# EAGLE design usbtinyisp_th (EAGLE 6.5.0)
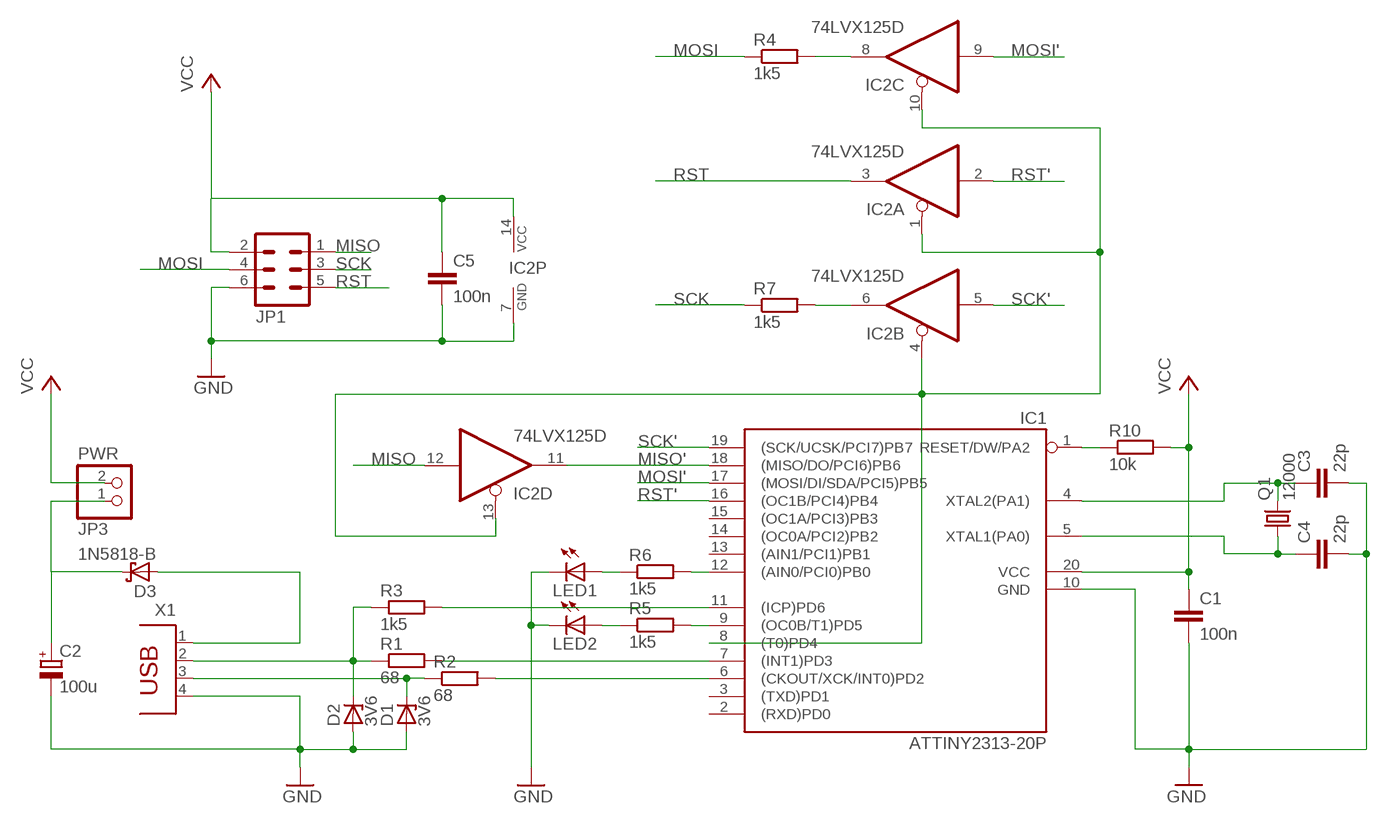
[diagram p0: schematic, sheet 1]

## Parts
C1  100n  C-EU025-025X050  [C025-025X050]
C2  100u  CPOL-EUE2.5-6  [E2,5-6]
C3  22p  C-EU025-025X050  [C025-025X050]
C4  22p  C-EU025-025X050  [C025-025X050]
C5  100n  C-EU025-025X050  [C025-025X050]
D1  3V6  ZENER-DIODEDO35Z10  [DO35Z10]
D2  3V6  ZENER-DIODEDO35Z10  [DO35Z10]
D3  1N5818-B  1N5817-B  [DO41-7.6]
IC1  ATTINY2313-20P  [DIL20]
IC2  74LVX125D  74HC125N  [DIL14]
JP1  MA03-2  [MA03-2]
JP3  PWR  PINHD-1X2  [1X02]
LED1  LED5MM  [LED5MM]
LED2  LED5MM  [LED5MM]
Q1  12000  CRYSTALHC49U-V  [HC49U-V]
R1  68  R-EU_0204/7  [0204/7]
R2  68  R-EU_0204/7  [0204/7]
R3  1k5  R-EU_0204/7  [0204/7]
R4  1k5  R-EU_0204/7  [0204/7]
R5  1k5  R-EU_0204/7  [0204/7]
R6  1k5  R-EU_0204/7  [0204/7]
R7  1k5  R-EU_0204/7  [0204/7]
R10  10k  R-EU_0204/7  [0204/7]
X1  PN61729  [PN61729]

## Nets
GND [supply]: C1.2 C2.- C3.2 C4.2 C5.2 D1.A D2.A IC1.10(GND) IC2.7(P:GND) JP1.6 LED1.K(C) LED2.K(C) X1.4
MISO: IC2.12(D:I) JP1.1
MISO': IC1.18((MISO/DO/PCI6)PB6) IC2.11(D:O)
MOSI: JP1.4 R4.1
MOSI': IC1.17((MOSI/DI/SDA/PCI5)PB5) IC2.9(C:I)
N$1: D2.C R1.1 R3.1 X1.2
N$2: D1.C R2.1 X1.3
N$3: IC1.7((INT1)PD3) R1.2
N$4 [supply]: C2.+ D3.C JP3.1
N$5: LED1.A R6.1
N$6: IC1.6((CKOUT/XCK/INT0)PD2) R2.2
N$7: IC1.12((AIN0/PCI0)PB0) R6.2
N$9: IC1.1(RESET/DW/PA2) R10.1
N$10: IC1.9((OC0B/T1)PD5) R5.2
N$11: LED2.A R5.1
N$12: IC2.6(B:O) R7.2
N$13: IC2.8(C:O) R4.2
N$15: IC1.8((T0)PD4) IC2.1(A:OE) IC2.4(B:OE) IC2.10(C:OE) IC2.13(D:OE)
N$16: IC1.11((ICP)PD6) R3.2
RST: IC2.3(A:O) JP1.5
RST': IC1.16((OC1B/PCI4)PB4) IC2.2(A:I)
SCK: JP1.3 R7.1
SCK': IC1.19((SCK/UCSK/PCI7)PB7) IC2.5(B:I)
VBUS [supply]: D3.A X1.1
VCC [supply]: C1.1 C5.1 IC1.20(VCC) IC2.14(P:VCC) JP1.2 JP3.2 R10.2
XTAL1: C4.1 IC1.5(XTAL1(PA0)) Q1.1
XTAL2: C3.1 IC1.4(XTAL2(PA1)) Q1.2
Unconnected: IC1.2((RXD)PD0) IC1.3((TXD)PD1) IC1.13((AIN1/PCI1)PB1) IC1.14((OC0A/PCI2)PB2) IC1.15((OC1A/PCI3)PB3)

## Library data of the parts
C1 C3-C5 = rcl:C-EU: CAPACITOR, European symbol
C2 = rcl:CPOL-EU: POLARIZED CAPACITOR, European symbol
D1 D2 = diode:ZENER-DIODE: Z-Diode
D3 = diode:1N581*: 1.0A SCHOTTKY BARRIER RECTIFIER Source: http://www.diodes.com/datasheets/ds23001.pdf
IC1 = avr:ATTINY2313: MICROCONTROLLER 2 Kbytes FLASH 128 bytes SRAM 128 bytes EEPROM USART USI
IC2 = 74xx-eu:74*125: Quad bus BUFFER, 3-state
JP1 = con-lstb:MA03-2: PIN HEADER; OC_FARNELL: unknown; OC_NEWARK: unknown
JP3 = pinhead:PINHD-1X2: PIN HEADER
LED1 LED2 = led:LED: LED OSRAM: - CHIPLED LG R971, LG N971, LY N971, LG Q971, LY Q971, LO R971, LY R971 LH N974, LH R974 LS Q976, LO Q976, LY Q976 LO Q996 - Hyper CHIPLED LW Q18S LB Q993, LB Q99A, LB R99A - SideLED LS A670, LO A670, LY A670, LG A670, LP A670 LB A673, LV A673, LT A673, LW A673 LH A674 LY A675 LS A676, LA A676, LO A676, LY A676, LW A676 LS A679, LY A679, LG A679 - Hyper Micro SIDELED® LS Y876, LA Y876, LO Y876, LY Y876 LT Y87S - SmartLED LW L88C, LW L88S LB L89C, LB L89S, LG L890 LS L89K, LO L89K, LY L89K LS L896, LA L896, LO L896, LY L896 - TOPLED LS T670, LO T670, LY T670, LG T670, LP T670 LSG T670, LSP T670, LSY T670, LOP T670, LYG T670 LG T671, LOG T671, LSG T671 LB T673, LV T673, LT T673, LW T673 LH T674 LS T676, LA T676, LO T676, LY T676, LB T676, LH T676, LSB T676, LW T676 LB T67C, LV T67C, LT T67C, LS T67K, LO T67K, LY T67K, LW E67C LS E67B, LA E67B, LO E67B, LY E67B, LB E67C, LV E67C, LT E67C LW T67C LS T679, LY T679, LG T679 LS T770, LO T770, LY T770, LG T770, LP T770 LB T773, LV T773, LT T773, LW T773 LH T774 LS E675, LA E675, LY E675, LS T675 LS T776, LA T776, LO T776, LY T776, LB T776 LHGB T686 LT T68C, LB T68C - Hyper Mini TOPLED® LB M676 - Mini TOPLED Santana® LG M470 LS M47K, LO M47K, LY M47K Source: http://www.osram.convergy.de LUXEON: - LUMILED® LXK2-PW12-R00, LXK2-PW12-S00, LXK2-PW14-U00, LXK2-PW14-V00 LXK2-PM12-R00, LXK2-PM12-S00, LXK2-PM14-U00 LXK2-PE12-Q00, LXK2-PE12-R00, LXK2-PE12-S00, LXK2-PE14-T00, LXK2-PE14-U00 LXK2-PB12-K00, LXK2-PB12-L00, LXK2-PB12-M00, LXK2-PB14-N00, LXK2-PB14-P00, LXK2-PB14-Q00 LXK2-PR12-L00, LXK2-PR12-M00, LXK2-PR14-Q00, LXK2-PR14-R00 LXK2-PD12-Q00, LXK2-PD12-R00, LXK2-PD12-S00 LXK2-PH12-R00, LXK2-PH12-S00 LXK2-PL12-P00, LXK2-PL12-Q00, LXK2-PL12-R00 Source: www.luxeon.com KINGBRIGHT: KA-3528ASYC Source: www.kingbright.com
Q1 = crystal:CRYSTAL: CRYSTAL; OC_FARNELL: 1666969; OC_NEWARK: unknown
R1-R7 R10 = rcl:R-EU_: RESISTOR, European symbol
X1 = con-berg-ez:PN61729: BERG USB connector

## Net classes
0 default: width 0.305 mm
1 supply: width 0.406 mm

## Board
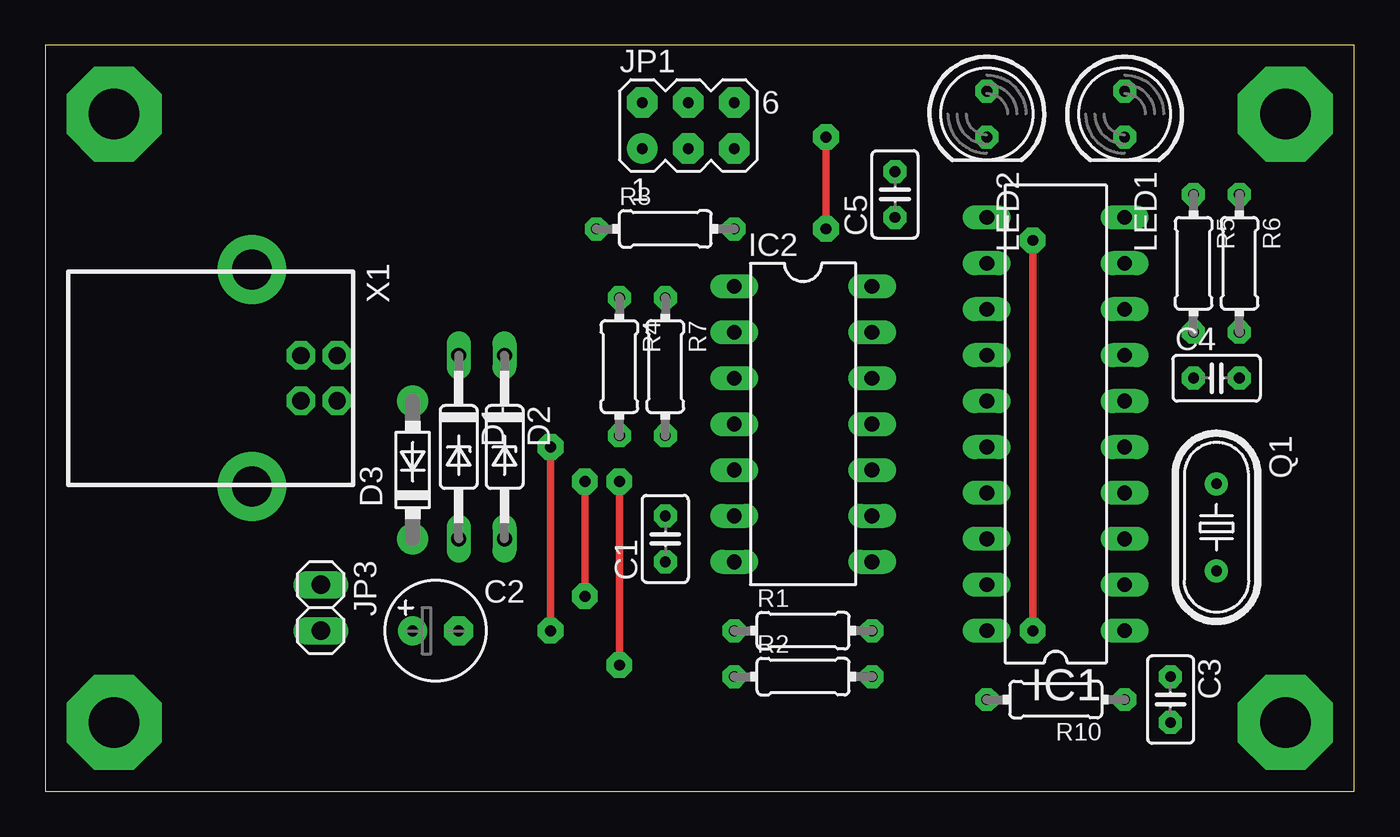
[diagram p1: board, top side]
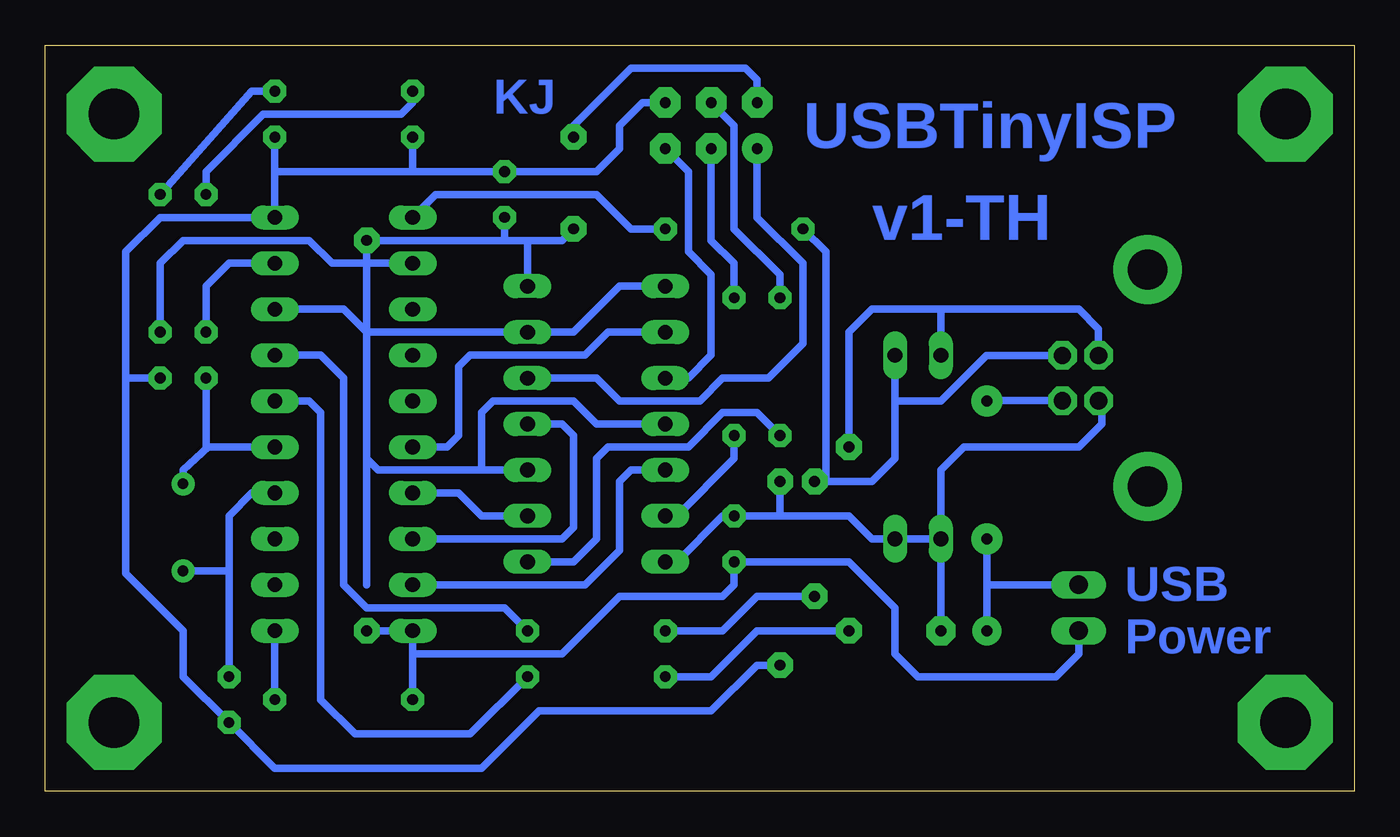
[diagram p2: board, bottom side, seen from below]

Size 72.39 x 41.27 mm. Coordinates in mm from the lower left corner, seen from the top.
Outline: 0,0 72.39,0 72.39,41.27 0,41.27 0,0
Copper layers (1*16): Top 0.035mm / dielectric 1.5mm / Bottom 0.035mm
Design rules "default": minimum track width 10mil, minimum drill 24mil, track to track 8mil, track to pad 8mil, pad to pad 8mil, via to via 8mil, smd to smd 8mil, copper to edge 40mil, drill to drill 8mil, minimum pad ring 10mil, minimum via ring 8mil, stop-mask expansion 4mil, vias tented up to drill 0mil, thermal gap 10mil

### Footprints (pad centres in the part's own frame; a part is rotated, then mirrored left to right if it is on the bottom)
C025-025X050 = drill 0.6 pad 1.27 octagon: 1 -1.27,0; 2 1.27,0
E2,5-6 = drill 0.6 pad 1.6: + -1.27,0 | drill 0.6 pad 1.6 octagon: - 1.27,0
DO35Z10 = drill 0.813 long: A 5.08,0; C -5.08,0
DO41-7.6 = drill 0.6 pad 1.7: A 3.81,0; C -3.81,0
DIL20 = drill 0.813 long: 1 -11.43,-3.81; 2 -8.89,-3.81; 3 -6.35,-3.81; 4 -3.81,-3.81; 5 -1.27,-3.81; 6 1.27,-3.81; 7 3.81,-3.81; 8 6.35,-3.81; 9 8.89,-3.81; 10 11.43,-3.81; 11 11.43,3.81; 12 8.89,3.81; 13 6.35,3.81; 14 3.81,3.81; 15 1.27,3.81; 16 -1.27,3.81; 17 -3.81,3.81; 18 -6.35,3.81; 19 -8.89,3.81; 20 -11.43,3.81
DIL14 = drill 0.813 long: 1 -7.62,-3.81; 2 -5.08,-3.81; 3 -2.54,-3.81; 4 0,-3.81; 5 2.54,-3.81; 6 5.08,-3.81; 7 7.62,-3.81; 8 7.62,3.81; 9 5.08,3.81; 10 2.54,3.81; 11 0,3.81; 12 -2.54,3.81; 13 -5.08,3.81; 14 -7.62,3.81
MA03-2 = drill 0.6 pad 1.676: 1 -2.54,-1.27 | drill 0.6 pad 1.676 octagon: 2 -2.54,1.27; 3 0,-1.27; 4 0,1.27; 5 2.54,-1.27; 6 2.54,1.27
1X02 = drill 1.016 long: 1 -1.27,0; 2 1.27,0
LED5MM = drill 0.6 pad 1.27 octagon: A -1.27,0; K 1.27,0
HC49U-V = drill 0.6 pad 1.27: 1 -2.413,0; 2 2.413,0
0204/7 = drill 0.6 pad 1.27 octagon: 1 -3.81,0; 2 3.81,0
PN61729 = drill 0.95 pad 1.575 octagon: 1 1.25,4.71; 2 -1.25,4.71; 3 -1.25,2.71; 4 1.25,2.71 | drill 2.2 pad 3.81: P$1 -6,0; P$2 6,0

### Placement (x,y rotation side)
C1  34.29,13.97 90 top
C2  21.59,8.89 0 top
C3  62.23,5.08 270 top
C4  64.77,22.86 0 top
C5  46.99,33.02 90 top
D1  22.86,19.05 270 top
D2  25.4,19.05 270 top
D3  20.32,17.78 90 top
IC1  55.88,20.32 90 top
IC2  41.91,20.32 270 top
JP1  35.56,36.83 0 top
JP3  15.24,10.16 270 top
LED1  59.69,37.47 270 top
LED2  52.07,37.47 270 top
Q1  64.77,14.61 270 top
R1  41.91,8.89 0 top
R2  41.91,6.35 0 top
R3  34.29,31.11 0 top
R4  31.75,23.5 270 top
R5  63.5,29.21 270 top
R6  66.04,29.21 270 top
R7  34.29,23.5 270 top
R10  55.88,5.08 180 top
X1  11.43,22.86 270 top

### Tracks (layer width: path | path; a pad name or v marks a point on that pad's centre or on a via)
GND  (via drill 0.6 pad 1.42)
  Top 0.406: v31.75,17.14 v31.75,6.99
  Bottom 0.406: IC2.7 37.47,12.7 34.92,15.24 C1.2 31.75,15.24 | 52.07,34.29 C5.2 41.91,34.29 40.64,35.56 40.64,36.83 39.37,38.1 JP1.6 | 59.69,34.29 52.07,34.29 | C2.- D1.A | D1.A D2.A 26.67,13.97 27.94,15.24 31.75,15.24 | D1.A 22.86,17.78 21.59,19.05 15.24,19.05 13.97,20.32 13.97,21.44 X1.4 | v31.75,17.14 31.75,15.24 | v31.75,6.99 33.02,6.99 35.56,4.45 45.09,4.45 48.26,1.27 59.69,1.27 C3.2 64.77,6.35 64.77,8.89 67.94,12.06 67.94,22.86 | LED2.K 52.07,34.29 | LED1.K 59.69,34.29 | 59.69,34.29 IC1.10 66.04,31.75 67.94,29.84 67.94,22.86 | C4.2 67.94,22.86
MISO
  Bottom 0.406: IC2.12 41.91,22.86 40.64,21.59 36.2,21.59 34.92,22.86 32.38,22.86 30.48,24.77 30.48,29.21 33.02,31.75 JP1.1
MISO'
  Bottom 0.406: IC1.18 43.81,13.97 43.18,14.61 43.18,19.68 43.81,20.32 IC2.11
MOSI
  Bottom 0.406: R4.1 31.75,28.57 34.29,31.11 34.29,36.83 JP1.4
MOSI'
  Bottom 0.406: IC1.17 49.53,16.51 48.26,15.24 IC2.9
N$1  (via drill 0.6 pad 1.42)
  Top 0.406: v29.84,10.79 v29.84,17.14
  Bottom 0.406: X1.2 20.34,24.11 22.86,21.59 25.4,21.59 | R1.1 34.92,8.89 33.02,10.79 v29.84,10.79 | R3.1 29.21,29.84 29.21,17.14 v29.84,17.14 26.67,17.14 25.4,18.41 25.4,21.59 | D2.C 25.4,21.59
N$2  (via drill 0.6 pad 1.42)
  Top 0.406: v27.94,8.89 v27.94,19.05
  Bottom 0.406: X1.3 14.14,25.57 15.24,26.67 22.86,26.67 | 22.86,26.67 D1.C | R2.1 35.56,6.35 33.02,8.89 v27.94,8.89 | v27.94,19.05 27.94,25.4 26.67,26.67 22.86,26.67
N$3
  Bottom 0.406: IC1.7 57.15,24.13 55.88,22.86 55.88,11.43 54.61,10.16 46.99,10.16 R1.2
N$4
  Bottom 0.406: C2.+ 20.32,11.43 | 20.32,11.43 D3.C | JP3.1 20.32,11.43
N$5
  Bottom 0.406: LED1.A 60.96,38.73 R6.1
N$6
  Bottom 0.406: IC1.6 57.78,21.59 57.15,20.95 57.15,5.08 55.24,3.17 48.9,3.17 R2.2
N$7
  Bottom 0.406: R6.2 66.04,29.21 64.77,30.48 57.78,30.48 56.52,29.21 IC1.12
N$8  (via drill 2.8 pad 5.25)
  other vias: 68.58,37.47
N$9
  Bottom 0.406: IC1.1 R10.1
N$10
  Bottom 0.406: R5.2 63.5,27.94 62.23,29.21 IC1.9
N$11
  Bottom 0.406: R5.1 63.5,34.29 60.33,37.47 52.7,37.47 52.07,38.1 LED2.A
N$12
  Bottom 0.406: R7.2 34.29,18.41 37.47,15.24 IC2.6
N$13
  Bottom 0.406: IC2.8 43.18,12.7 41.91,13.97 41.91,18.41 41.27,19.05 36.83,19.05 34.92,20.95 33.02,20.95 R4.2
N$14  (via drill 2.8 pad 5.25)
  other vias: 68.58,3.81
N$15
  Bottom 0.406: IC1.8 55.88,26.67 54.61,25.4 | 54.61,25.4 IC2.13 43.18,25.4 40.64,27.94 IC2.1 | IC2.10 48.26,17.78 | 48.26,17.78 53.98,17.78 54.61,18.41 54.61,25.4 | IC2.4 41.91,20.32 43.18,21.59 47.62,21.59 48.26,20.95 48.26,17.78
N$16
  Bottom 0.406: IC1.11 50.8,33.02 41.91,33.02 40.01,31.11 R3.2
N$17  (via drill 2.8 pad 5.25)
  other vias: 3.81,3.81
N$18  (via drill 2.8 pad 5.25)
  other vias: 3.81,37.47
RST
  Bottom 0.406: IC2.3 36.83,22.86 35.56,24.13 35.56,28.57 36.83,29.84 36.83,34.29 JP1.5
RST'
  Bottom 0.406: IC1.16 50.16,19.05 49.53,19.68 49.53,23.5 48.9,24.13 42.55,24.13 41.27,25.4 IC2.2
SCK
  Bottom 0.406: R7.1 34.29,29.21 35.56,30.48 JP1.3
SCK'
  Bottom 0.406: IC1.19 42.55,11.43 40.64,13.34 40.64,17.14 40.01,17.78 IC2.5
VBUS
  Bottom 0.406: X1.1 20.3,21.61 D3.A
VCC  (via drill 0.6 pad 1.42)
  Top 0.406: v54.61,8.89 v54.61,30.48 | v43.18,31.11 v43.18,36.2
  Bottom 0.406: 52.07,7.62 R10.2 | 54.61,11.43 v54.61,30.48 46.99,30.48 | v54.61,8.89 IC1.20 52.07,7.62 | 52.07,7.62 43.81,7.62 40.64,10.79 34.92,10.79 34.29,11.43 C1.1 27.94,12.7 25.4,10.16 25.4,7.62 24.13,6.35 16.51,6.35 15.24,7.62 JP3.2 | IC2.14 45.72,30.48 | 46.99,30.48 45.72,30.48 | C5.1 46.99,30.48 | JP1.2 33.02,39.37 33.66,40.01 40.01,40.01 43.18,36.83 v43.18,36.2 | 45.72,30.48 43.81,30.48 v43.18,31.11
XTAL1
  Bottom 0.406: C4.1 63.5,19.05 63.37,19.05 | IC1.5 63.37,19.05 | 63.37,19.05 64.77,17.78 Q1.1
XTAL2
  Bottom 0.406: IC1.4 60.96,16.51 62.23,15.24 62.23,12.06 | C3.1 62.23,12.06 | Q1.2 62.36,12.19 62.23,12.06

### Text on the board
Bottom: KJ | USBTinyISP | v1-TH | USB / Power